# EasyEDA schematic StepperControlUnit_schematic.json

## Sheets
1 Sheet_1: TITLE: Sheet_1; REV: 1.0; Date: 2022-10-22; Sheet: 1/1; Drawn By: OnVan; Company: Your Company
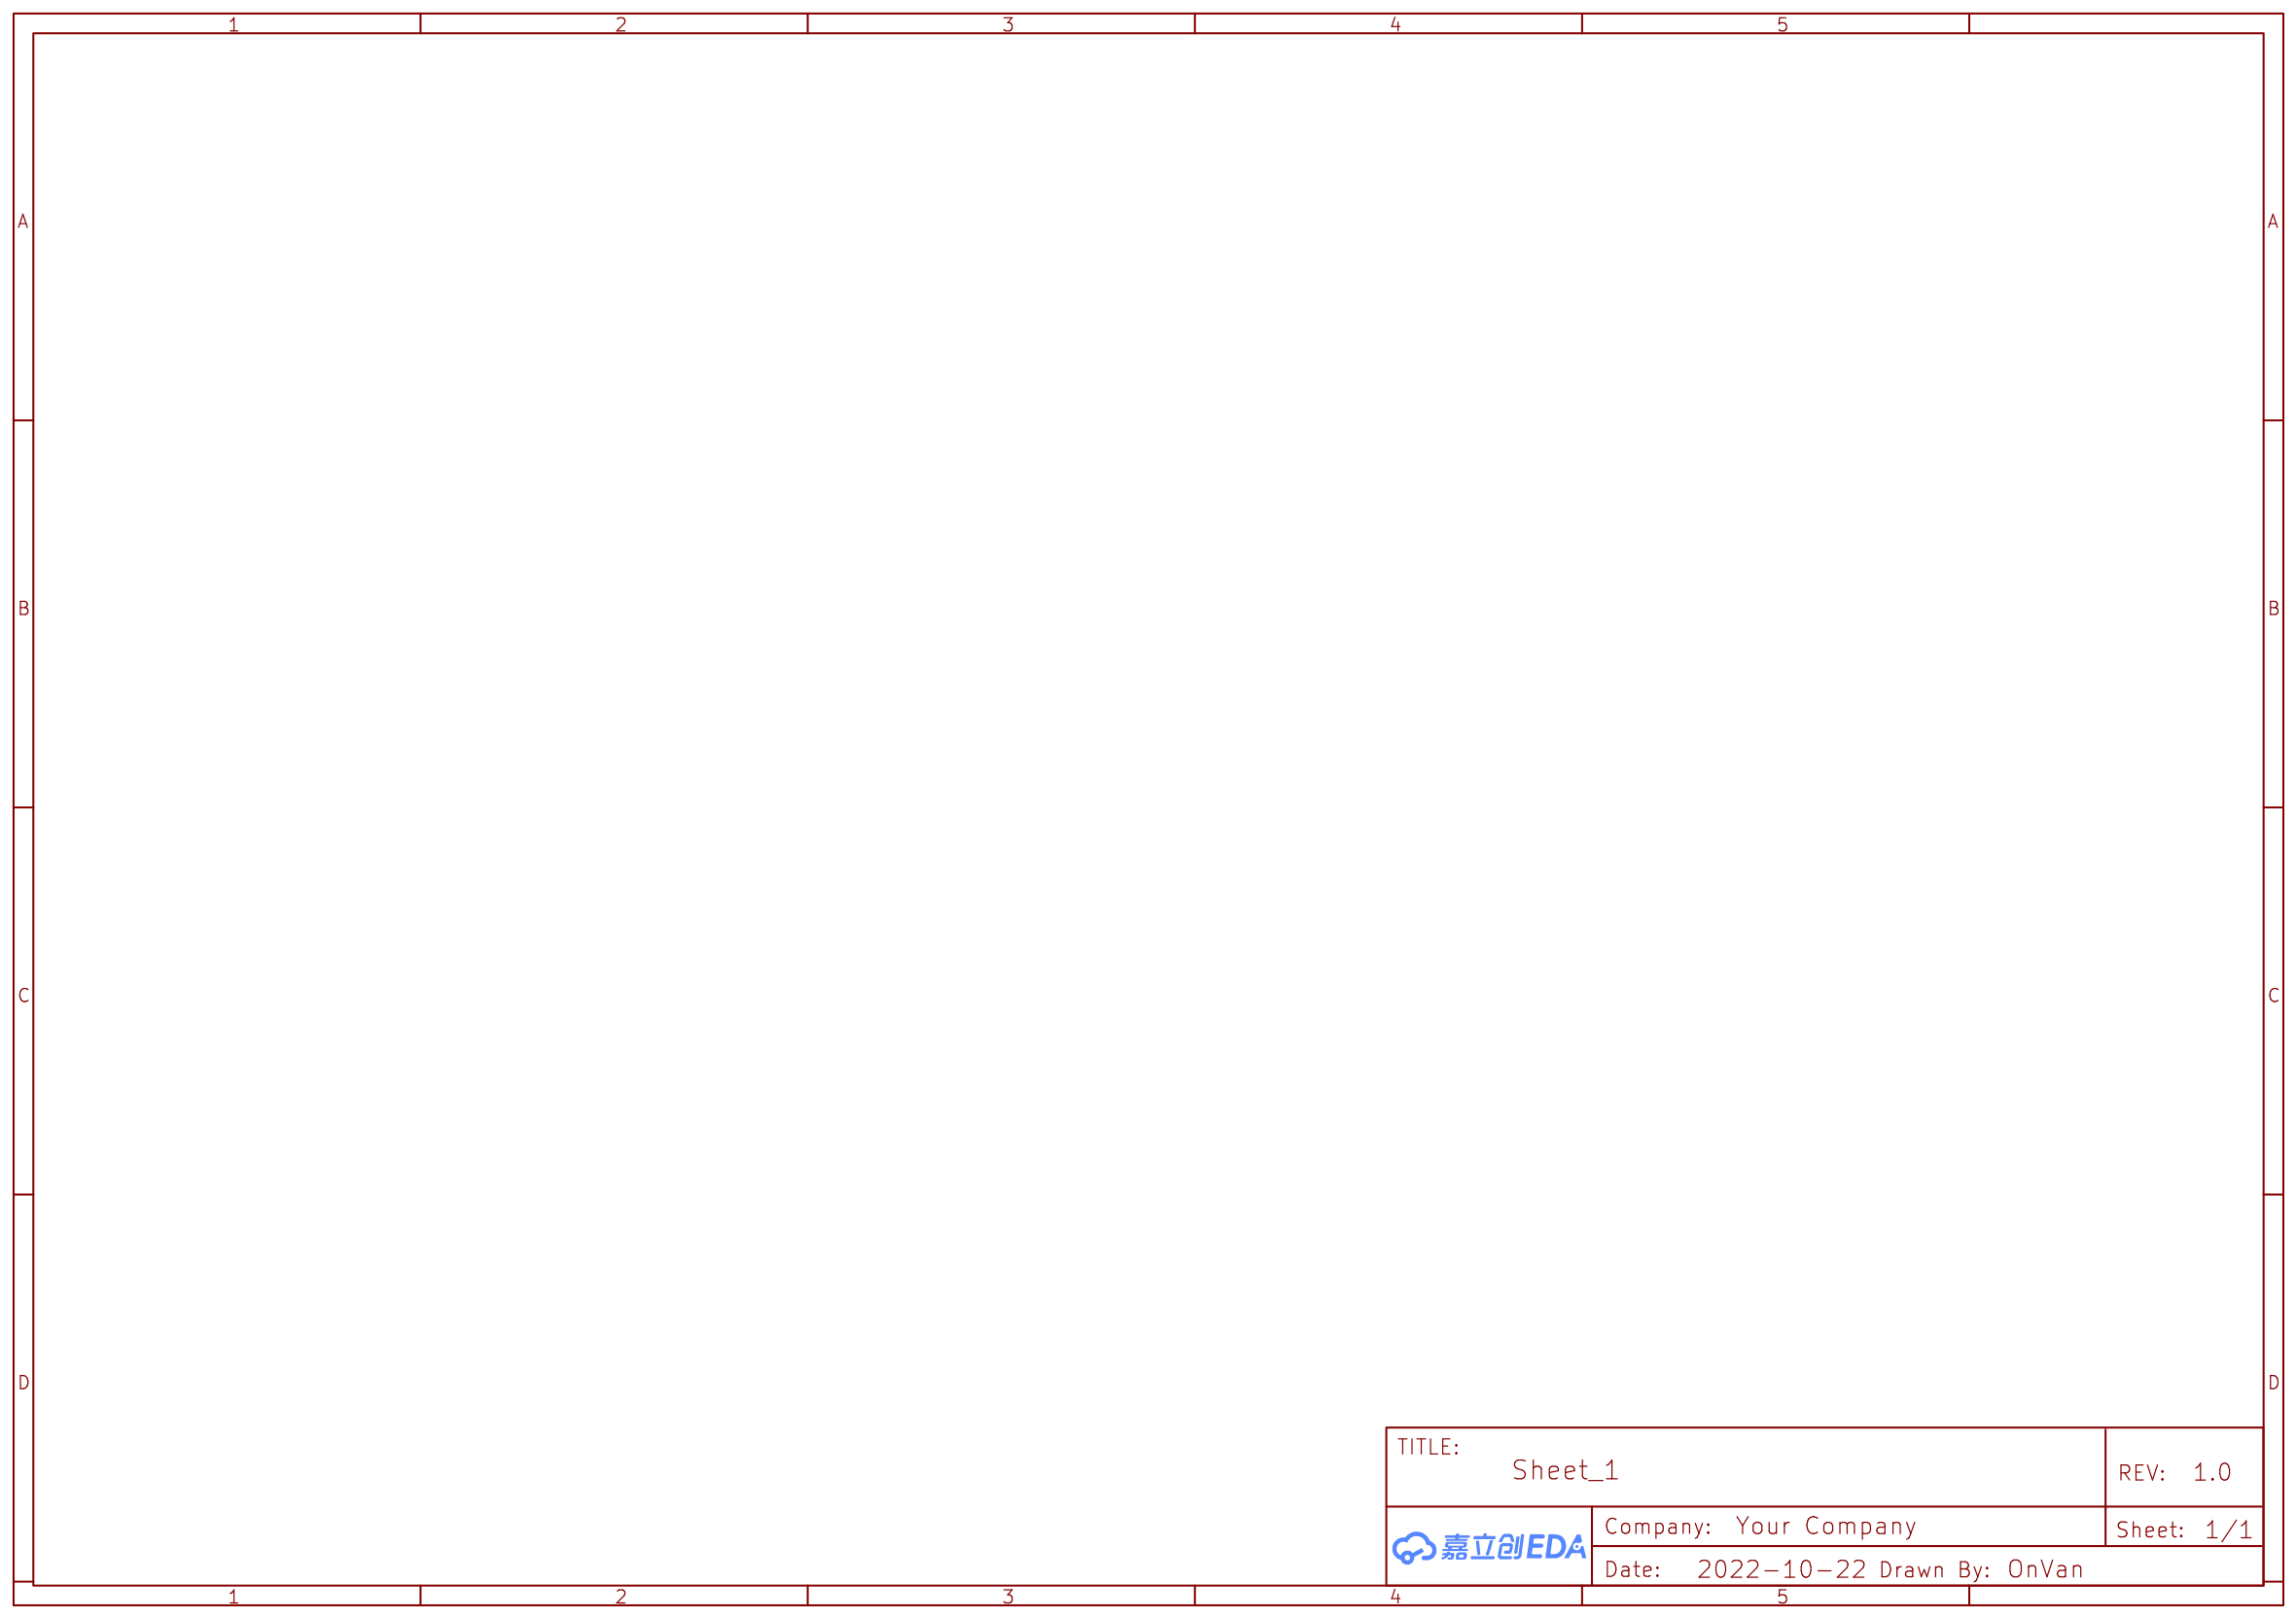
[diagram p0: Sheet_1]
2 AT1614_con: Date: 2022-11-05
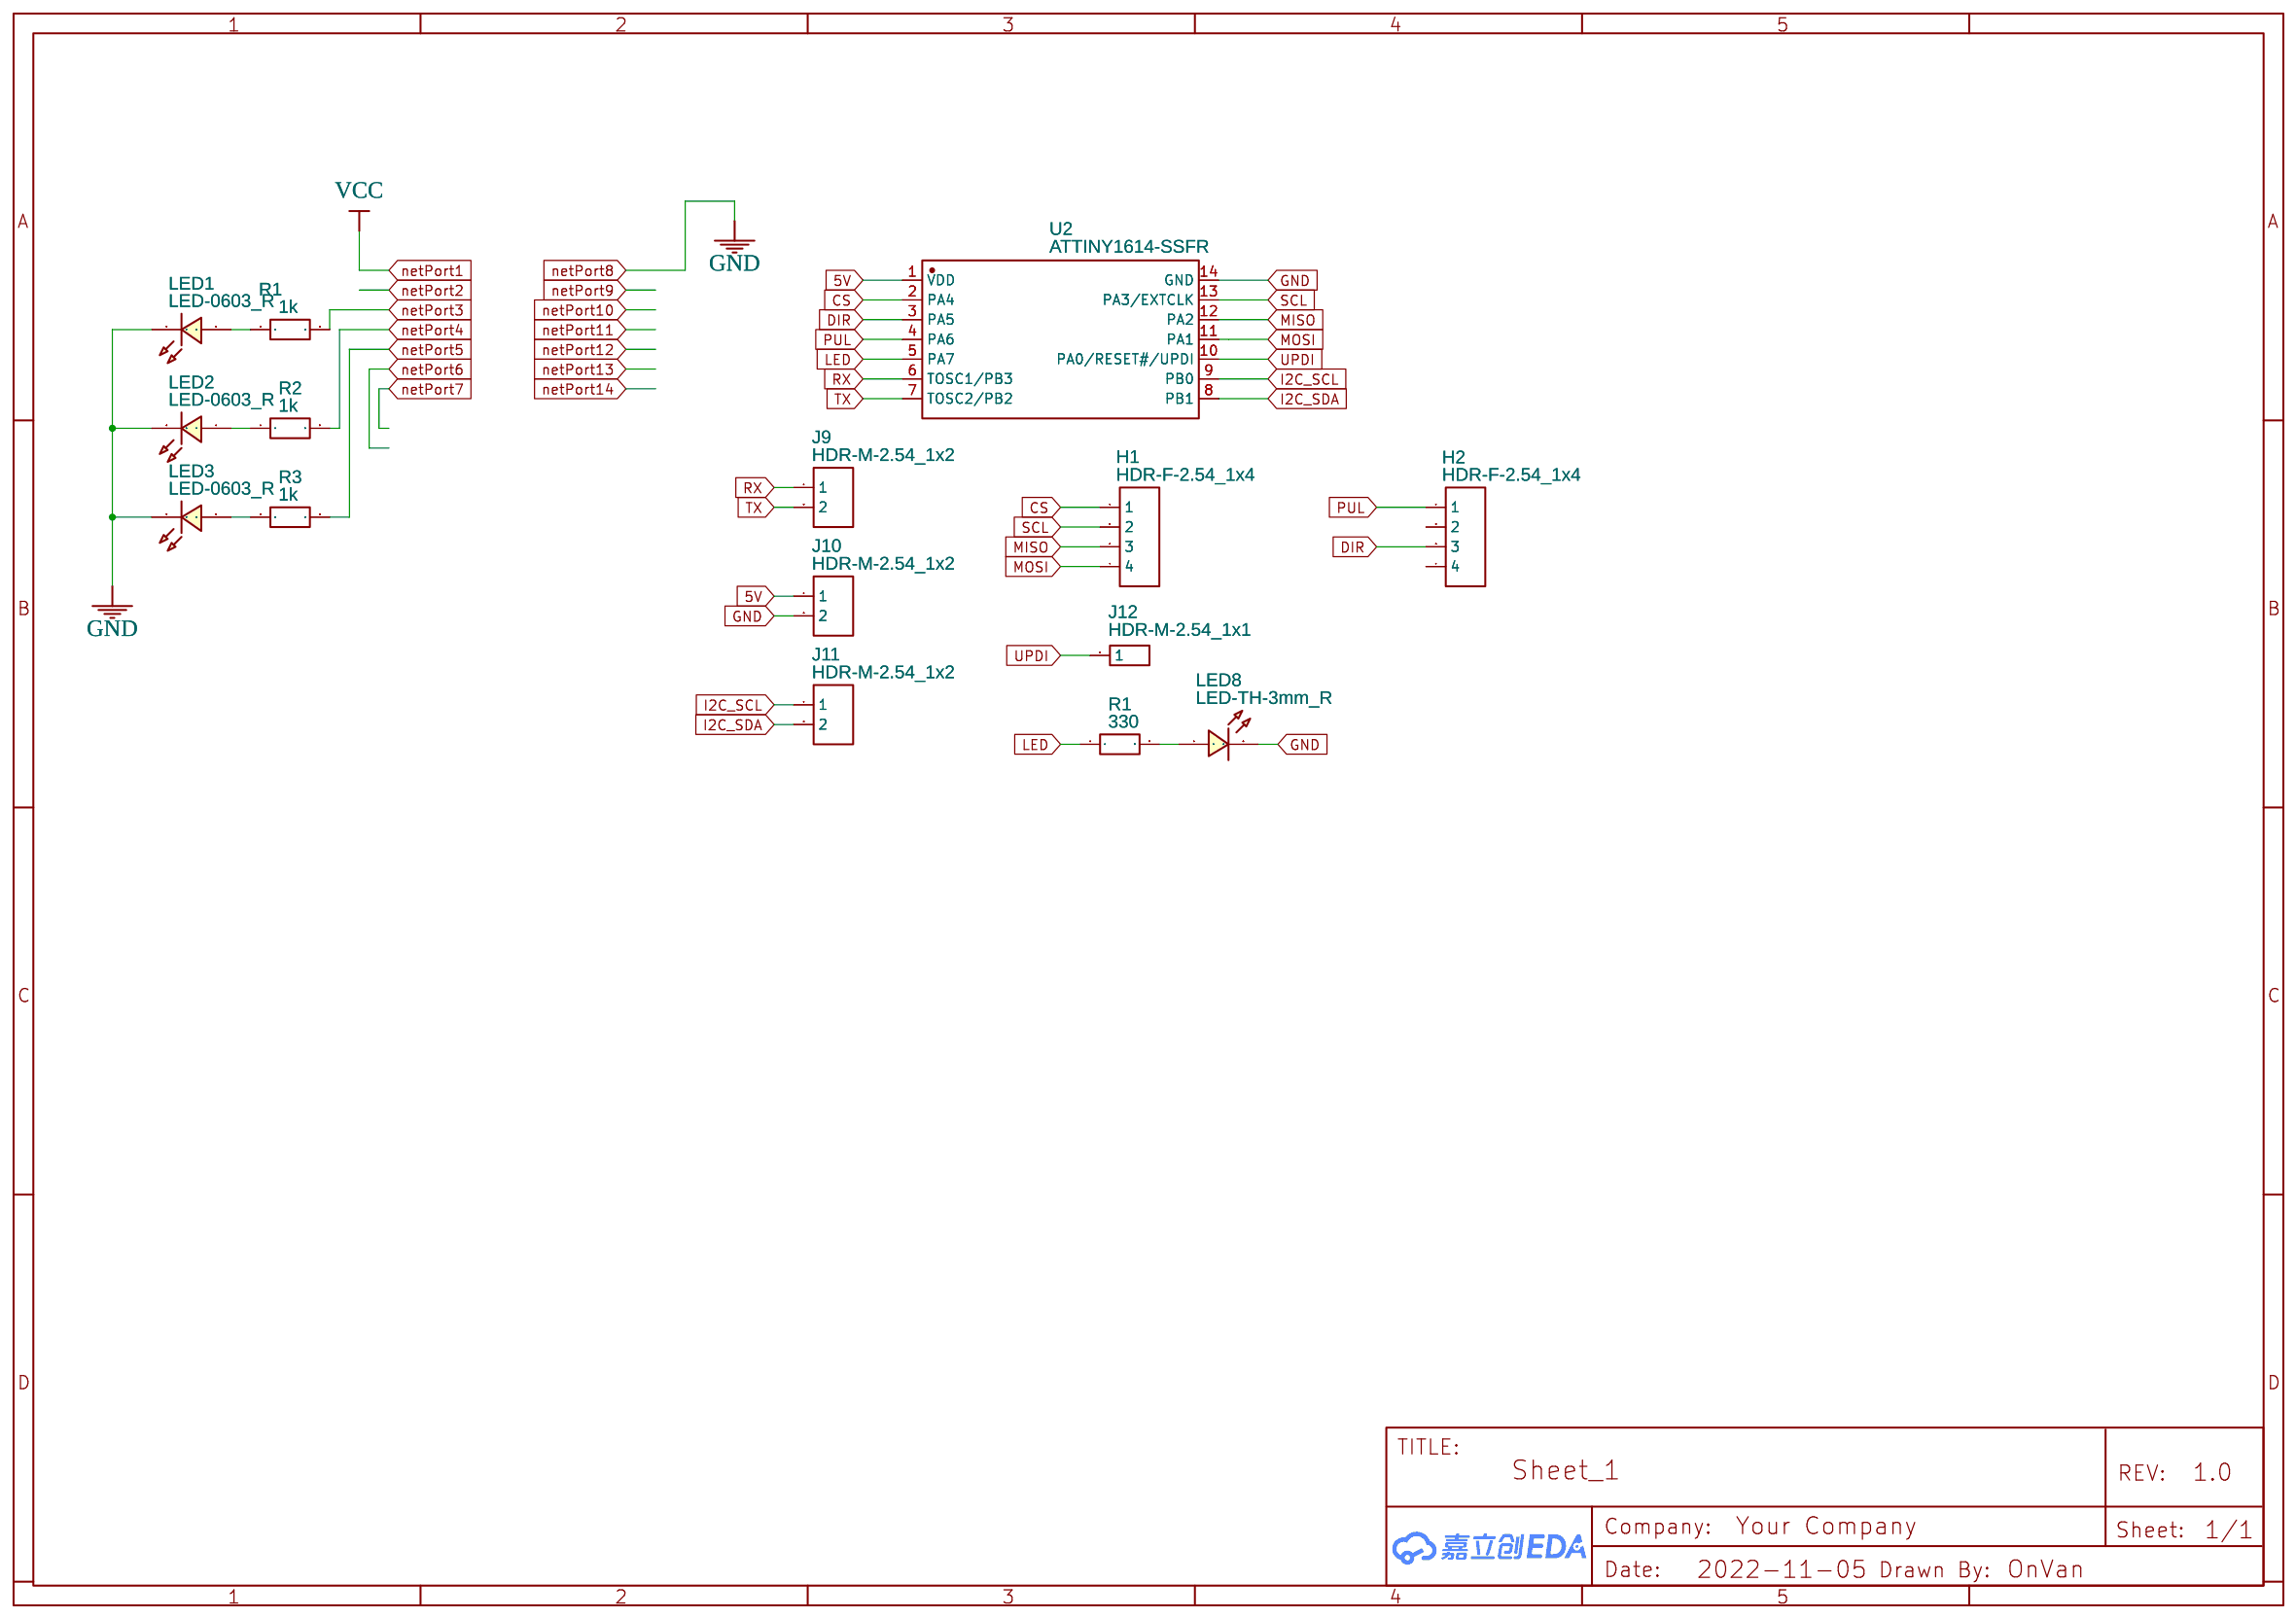
[diagram p1: AT1614_con]
3 ESP: TITLE: ESP; Date: 2022-11-12
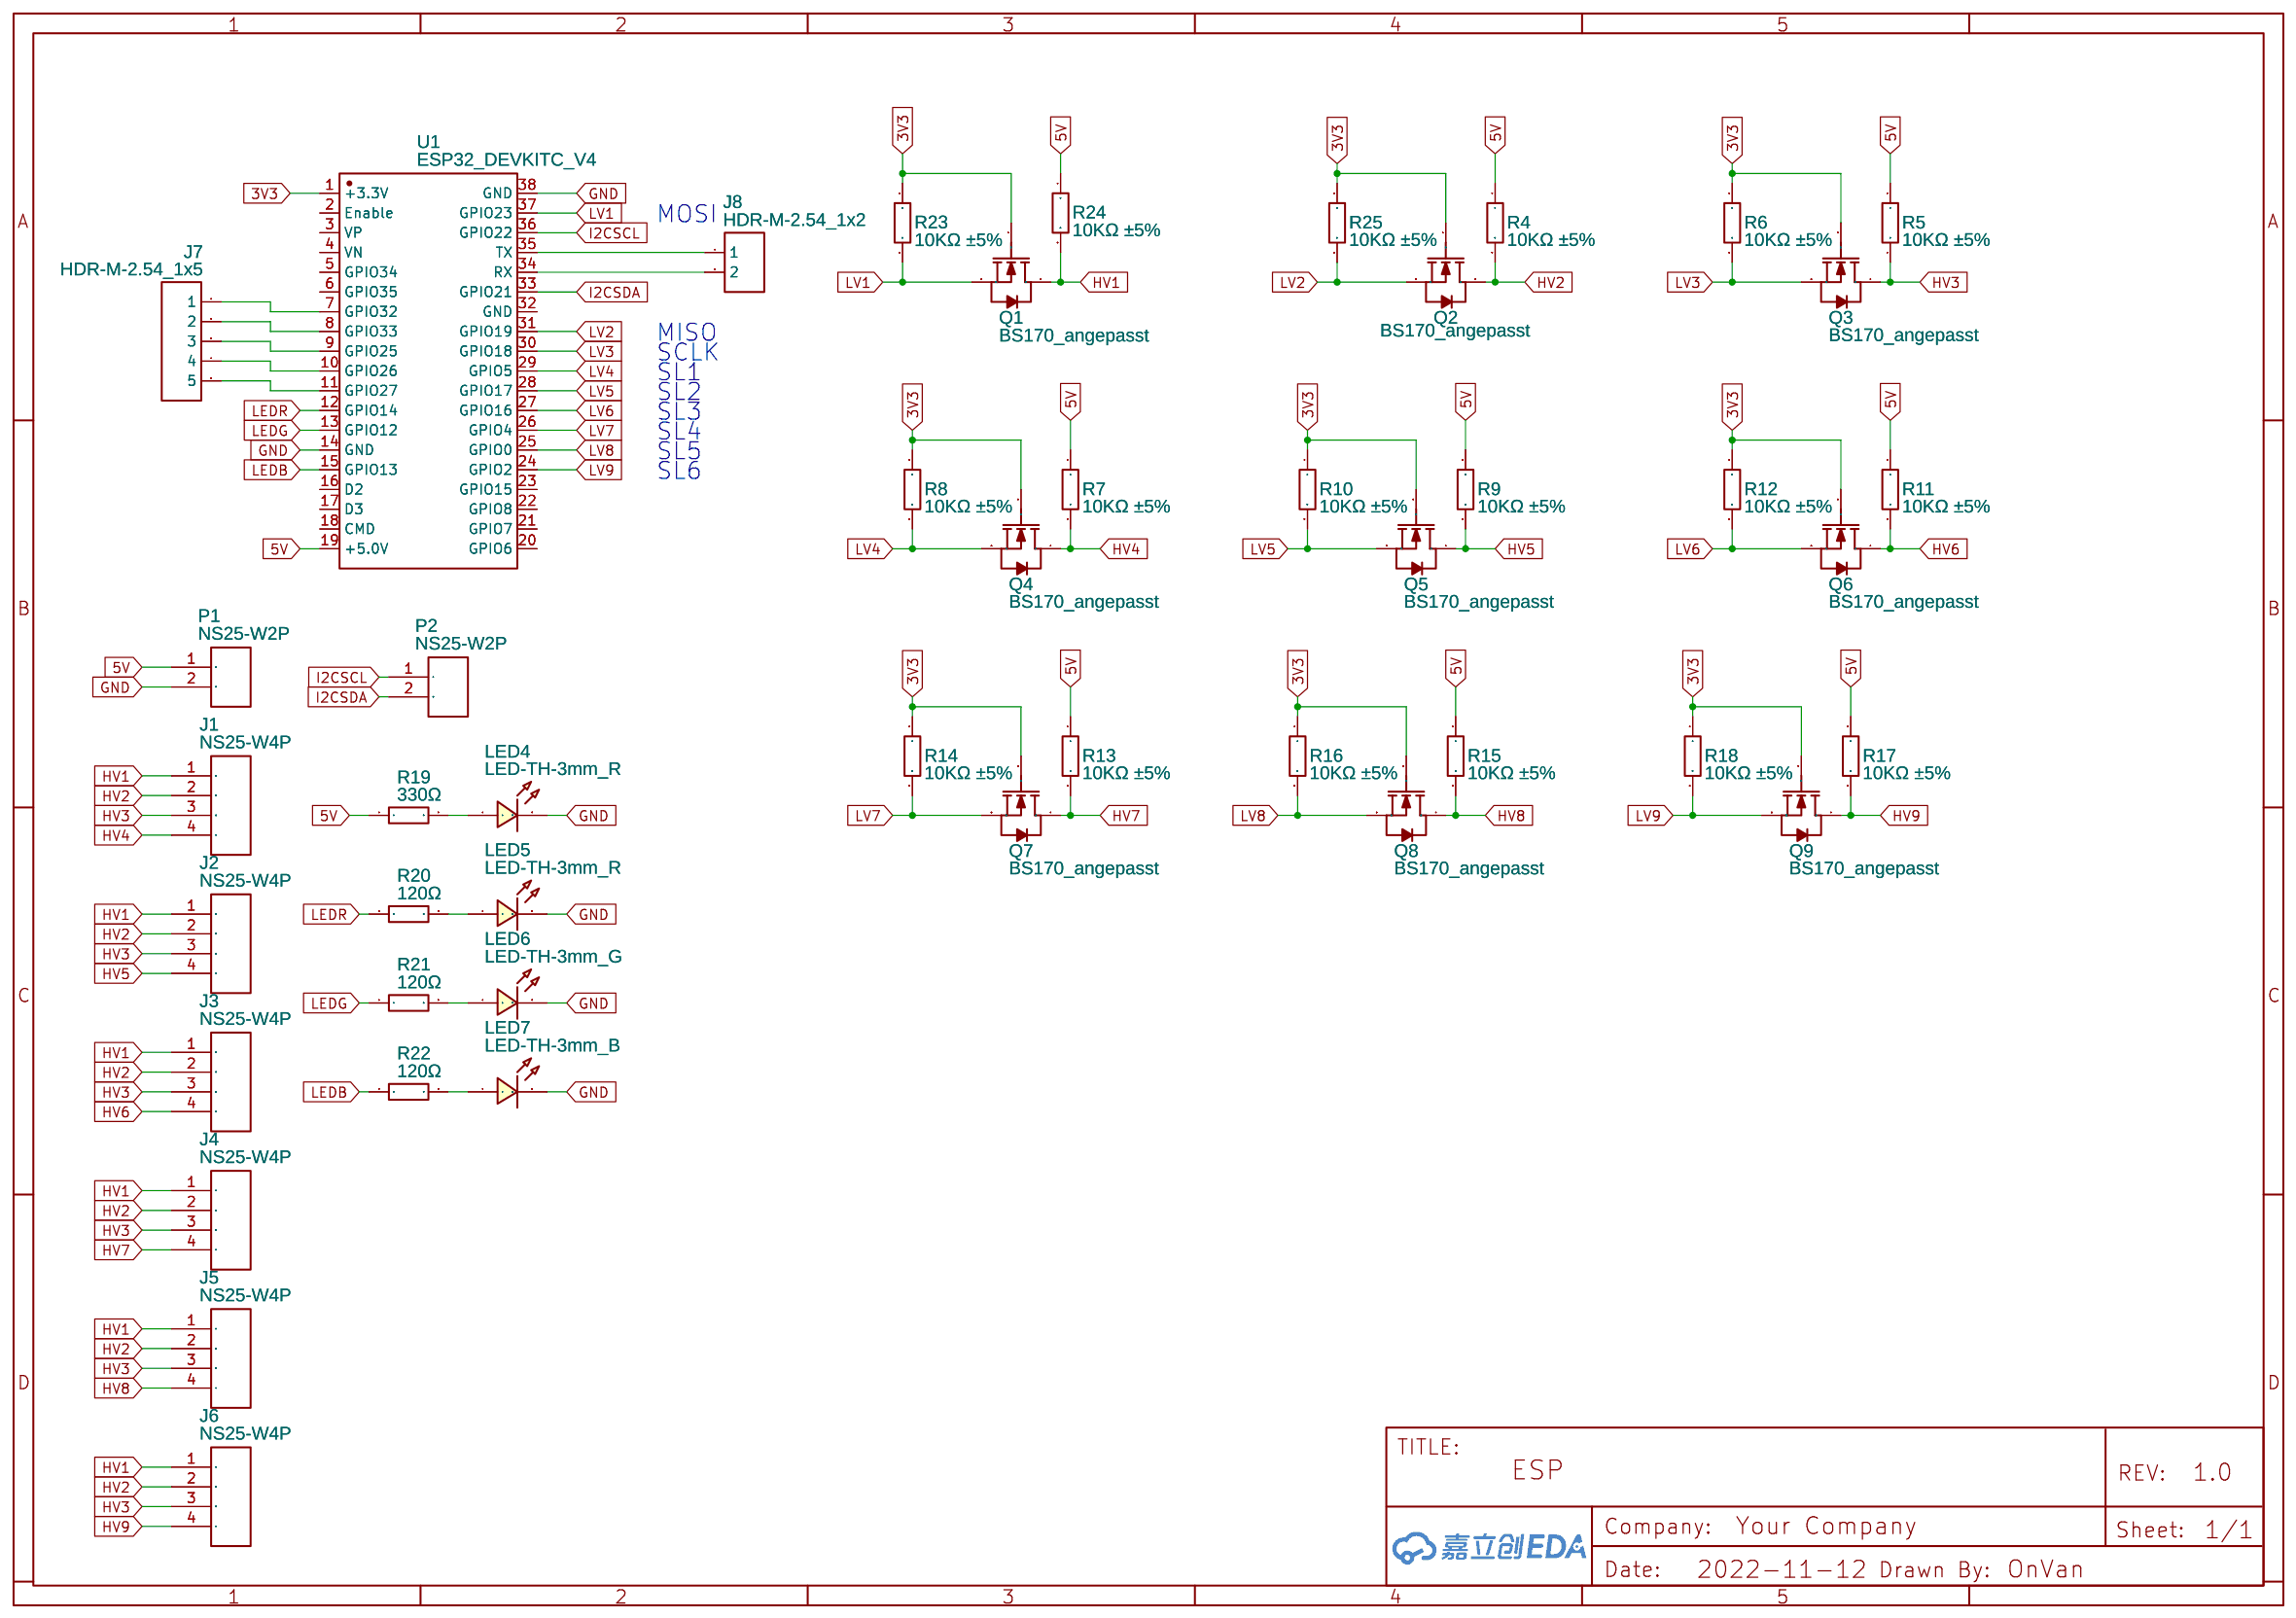
[diagram p2: ESP]

## Parts
sheet AT1614_con
H1  HDR-F-2.54_1x4  [HDR-F-2.54_1X4]
H2  HDR-F-2.54_1x4  [HDR-F-2.54_1X4]
J9  HDR-M-2.54_1x2  [HDR-M-2.54_1X2]
J10  HDR-M-2.54_1x2  [HDR-M-2.54_1X2]
J11  HDR-M-2.54_1x2  [HDR-M-2.54_1X2]
J12  HDR-M-2.54_1x1  [HDR-M-2.54_1X1]
LED1  LED-0603_R  [LED0603_RED]
LED2  LED-0603_R  [LED0603_RED]
LED3  LED-0603_R  [LED0603_RED]
LED8  LED-TH-3mm_R  [LED-TH_BD3.0_RED]
R1  1k  [R_AXIAL-0.5]
R1#2  330  [R_AXIAL-0.5]
R2  1k  [R_AXIAL-0.5]
R3  1k  [R_AXIAL-0.5]
U2  ATTINY1614-SSFR  [SOIC-14_L8.7-W3.9-P1.27-LS6.0-BL]
sheet ESP
J1  NS25-W4P  [NS25-W4P]
J2  NS25-W4P  [NS25-W4P]
J3  NS25-W4P  [NS25-W4P]
J4  NS25-W4P  [NS25-W4P]
J5  NS25-W4P  [NS25-W4P]
J6  NS25-W4P  [NS25-W4P]
J7  HDR-M-2.54_1x5  [HDR-M-2.54_1X5]
J8  HDR-M-2.54_1x2  [HDR-M-2.54_1X2]
LED4  LED-TH-3mm_R  [LED-TH_BD3.0_RED]
LED5  LED-TH-3mm_R  [LED-TH_BD3.0_RED]
LED6  LED-TH-3mm_G  [LED-TH_BD3.0_GREEN]
LED7  LED-TH-3mm_B  [LED-TH_BD3.0_BLUE]
P1  NS25-W2P  [NS25-W2P]
P2  NS25-W2P  [NS25-W2P]
Q1  BS170_angepasst  [BS170_ONWFOOTPRINT]
Q2  BS170_angepasst  [BS170_ONWFOOTPRINT]
Q3  BS170_angepasst  [BS170_ONWFOOTPRINT]
Q4  BS170_angepasst  [BS170_ONWFOOTPRINT]
Q5  BS170_angepasst  [BS170_ONWFOOTPRINT]
Q6  BS170_angepasst  [BS170_ONWFOOTPRINT]
Q7  BS170_angepasst  [BS170_ONWFOOTPRINT]
Q8  BS170_angepasst  [BS170_ONWFOOTPRINT]
Q9  BS170_angepasst  [BS170_ONWFOOTPRINT]
R4  10KΩ ±5%  [RESISTANCE 10K]
R5  10KΩ ±5%  [RESISTANCE 10K]
R6  10KΩ ±5%  [RESISTANCE 10K]
R7  10KΩ ±5%  [RESISTANCE 10K]
R8  10KΩ ±5%  [RESISTANCE 10K]
R9  10KΩ ±5%  [RESISTANCE 10K]
R10  10KΩ ±5%  [RESISTANCE 10K]
R11  10KΩ ±5%  [RESISTANCE 10K]
R12  10KΩ ±5%  [RESISTANCE 10K]
R13  10KΩ ±5%  [RESISTANCE 10K]
R14  10KΩ ±5%  [RESISTANCE 10K]
R15  10KΩ ±5%  [RESISTANCE 10K]
R16  10KΩ ±5%  [RESISTANCE 10K]
R17  10KΩ ±5%  [RESISTANCE 10K]
R18  10KΩ ±5%  [RESISTANCE 10K]
R19  330Ω  [AXIAL-0.4]
R20  120Ω  [AXIAL-0.4]
R21  120Ω  [AXIAL-0.4]
R22  120Ω  [AXIAL-0.4]
R23  10KΩ ±5%  [RESISTANCE 10K]
R24  10KΩ ±5%  [RESISTANCE 10K]
R25  10KΩ ±5%  [RESISTANCE 10K]
U1  ESP32_DEVKITC_V4  [ESP32-DEVKITC CORE BOARD ESP32]

## Library data of the parts
H1 H2 = HDR-F-2.54_1x4: Supplier Part: C225501; Supplier: LCSC; Contributor: LCEDA_Lib
J8-J11 = HDR-M-2.54_1x2: Supplier Part: C124375; Supplier: LCSC; Contributor: LCEDA_Lib
J12 = HDR-M-2.54_1x1: Supplier Part: C81276; Supplier: LCSC; Contributor: LCEDA_Lib
LED1-LED3 = LED-0603_R: Manufacturer: EVERLIGHT(台湾亿光); Manufacturer Part: 19-217/R6C-AL1M2VY/3T; Supplier Part: C72044; Supplier: LCSC; Contributor: LCEDA_01
LED4 LED5 LED8 = LED-TH-3mm_R: Manufacturer: EVERLIGHT(台湾亿光); Manufacturer Part: 204-10SDRD/S530-A3-L; Supplier Part: C84774; Supplier: LCSC; Contributor: LCEDA_Lib
R1 R1#2 R2 R3 = R_AXIAL-0.5_EU: Contributor: LCEDA_Lib
U2 = ATTINY1614-SSFR: Supplier: LCSC; Supplier Part: C141724; Manufacturer: MICROCHIP(美国微芯); Contributor: LCSC; JLCPCB Part Class: Extended Part
J1-J6 = NS25-W4P: link: https://www.tme.eu/ru/Document/f4fbc03349849389d5a444932ab1e0cf/ns25-w2p.pdf; Contributor: kulibinboris
J7 = HDR-M-2.54_1x5: Supplier Part: C358687; Supplier: LCSC; Contributor: LCEDA_Lib
LED6 = LED-TH-3mm_G: Manufacturer: EVERLIGHT(台湾亿光); Manufacturer Part: 204-10SYGD/S530-E3; Supplier Part: C85161; Contributor: LCEDA_Lib
LED7 = LED-TH-3mm_B: Manufacturer: EVERLIGHT(台湾亿光); Manufacturer Part: 204-10SUBC/S400-A4; Supplier Part: C86881; Supplier: LCSC; Contributor: LCEDA_Lib
P1 P2 = NS25-W2P: Contributor: kulibinboris; link: https://www.tme.eu/ru/Document/f4fbc03349849389d5a444932ab1e0cf/ns25-w2p.pdf
Q1-Q9 = BS170_angepasst: Supplier: LCSC; Manufacturer: FAIRCHILD; Manufacturer Part: BS170; Supplier Part: C111691; Contributor: Nostalgie
R4-R18 R23-R25 = Resistance 10k: Supplier: LCSC; Supplier Part: C123392; Manufacturer: Nanjing Shiheng Elec; Manufacturer Part: MF58 103J3470; Contributor: taha.satoglu; JLCPCB Part Class: Extended Part
R19 = MFR0W4F3300A50: Supplier: LCSC; Manufacturer: UniOhm; Supplier Part: C58608; Contributor: deepak yadav
R20-R22 = 120Ω: Power: 1/4W; Tolerance: ±1%; Supplier Part: C57439; Supplier: LCSC; Manufacturer: UniOhm; Manufacturer Part: MFR0W4F2200A50
U1 = ESP32_DEVKITC_V4: Supplier Part: A5130; link: https://www.allnewstep.com/product/5253/%E0%B8%9A%E0%B8%AD%E0%B8%A3%E0%B9%8C%E0%B8%94-esp32-devkitc-core-board-esp32-v4-development-board-esp32-wroom-32u; Contributor: petch.elec14

## Nets
3V3: Q1.2(G) Q2.2(G) Q3.2(G) Q4.2(G) Q5.2(G) Q6.2(G) Q7.2(G) Q8.2(G) Q9.2(G) R6.1 R8.1 R10.1 R12.1 R14.1 R16.1 R18.1 R23.1 R25.1 U1.1(+3.3V)
5V: J10.1 P1.1 R4.1 R5.1 R7.1 R9.1 R11.1 R13.1 R15.1 R17.1 R19.1 R24.1 U1.19(+5.0V) U2.1(VDD)
GND: J10.2 LED1.2 LED2.2 LED3.2 LED4.2 LED5.2 LED6.2 LED7.2 LED8.2 P1.2 U1.14(GND) U1.38(GND) U2.14(GND)
CS: H1.1 U2.2(PA4)
DIR: H2.3 U2.3(PA5)
HV1: J1.1 J2.1 J3.1 J4.1 J5.1 J6.1 Q1.1(D) R24.2
HV2: J1.2 J2.2 J3.2 J4.2 J5.2 J6.2 Q2.1(D) R4.2
HV3: J1.3 J2.3 J3.3 J4.3 J5.3 J6.3 Q3.1(D) R5.2
HV4: J1.4 Q4.1(D) R7.2
HV5: J2.4 Q5.1(D) R9.2
HV6: J3.4 Q6.1(D) R11.2
HV7: J4.4 Q7.1(D) R13.2
HV8: J5.4 Q8.1(D) R15.2
HV9: J6.4 Q9.1(D) R17.2
I2C_SCL: J11.1 U2.9(PB0)
I2C_SDA: J11.2 U2.8(PB1)
I2CSCL: P2.1 U1.36(GPIO22)
I2CSDA: P2.2 U1.33(GPIO21)
LED: R1#2.1 U2.5(PA7)
LEDB: R22.1 U1.15(GPIO13)
LEDG: R21.1 U1.13(GPIO12)
LEDR: R20.1 U1.12(GPIO14)
LV1: Q1.3(S) R23.2 U1.37(GPIO23)
LV2: Q2.3(S) R25.2 U1.31(GPIO19)
LV3: Q3.3(S) R6.2 U1.30(GPIO18)
LV4: Q4.3(S) R8.2 U1.29(GPIO5)
LV5: Q5.3(S) R10.2 U1.28(GPIO17)
LV6: Q6.3(S) R12.2 U1.27(GPIO16)
LV7: Q7.3(S) R14.2 U1.26(GPIO4)
LV8: Q8.3(S) R16.2 U1.25(GPIO0)
LV9: Q9.3(S) R18.2 U1.24(GPIO2)
MISO: H1.3 U2.12(PA2)
MOSI: H1.4 U2.11(PA1)
netPort3: R1.2
netPort4: R2.2
netPort5: R3.2
PUL: H2.1 U2.4(PA6)
RX: J9.1 U2.6(TOSC1/PB3)
SCL: H1.2 U2.13(PA3/EXTCLK)
TX: J9.2 U2.7(TOSC2/PB2)
UPDI: J12.1 U2.10(PA0/RESET#/UPDI)
Net-(J7-1): J7.1 U1.7(GPIO32)
Net-(J7-2): J7.2 U1.8(GPIO33)
Net-(J7-3): J7.3 U1.9(GPIO25)
Net-(J7-4): J7.4 U1.10(GPIO26)
Net-(J7-5): J7.5 U1.11(GPIO27)
Net-(J8-1): J8.1 U1.35(TX)
Net-(J8-2): J8.2 U1.34(RX)
Net-(LED1-1): LED1.1 R1.1
Net-(LED2-1): LED2.1 R2.1
Net-(LED3-1): LED3.1 R3.1
Net-(LED4-1): LED4.1 R19.2
Net-(LED5-1): LED5.1 R20.2
Net-(LED6-1): LED6.1 R21.2
Net-(LED7-1): LED7.1 R22.2
Net-(LED8-1): LED8.1 R1#2.2

Not connected (* = marked no-connect by the designer): H2 2 4; U1 2(Enable) 3(VP) 4(VN) 5(GPIO34) 6(GPIO35) 16(D2) 17(D3) 18(CMD) 20(GPIO6) 21(GPIO7) 22(GPIO8) 23(GPIO15) 32(GND)

## Notes on the sheets
sheet 3
- MOSI
- MISO
- SCLK
- SL1
- SL2
- SL3
- SL4
- SL5
- SL6
